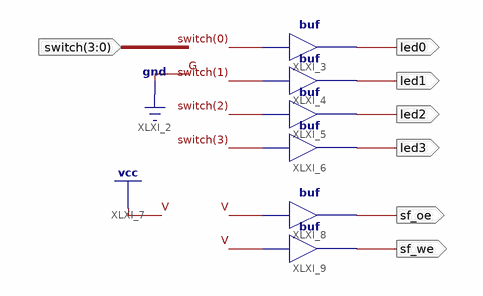
[diagram p0: schematic sheet 1]
// Xilinx ISE schematic io_block.sch (spartan3e) as structural Verilog: 6 symbols, 8 ports
module io_block (
  input  [3:0] switch,
  output V,
  output led0,
  output led1,
  output led2,
  output led3,
  output sf_oe,
  output sf_we
);

  buf XLXI_3 (led0, switch[0]);
  buf XLXI_4 (led1, switch[1]);
  buf XLXI_5 (led2, switch[2]);
  buf XLXI_6 (led3, switch[3]);
  buf XLXI_8 (sf_oe, 1'b1);
  buf XLXI_9 (sf_we, 1'b1);

  assign V = 1'b1;
endmodule
